# EAGLE design Clock1.3 (EAGLE 7.5.0)
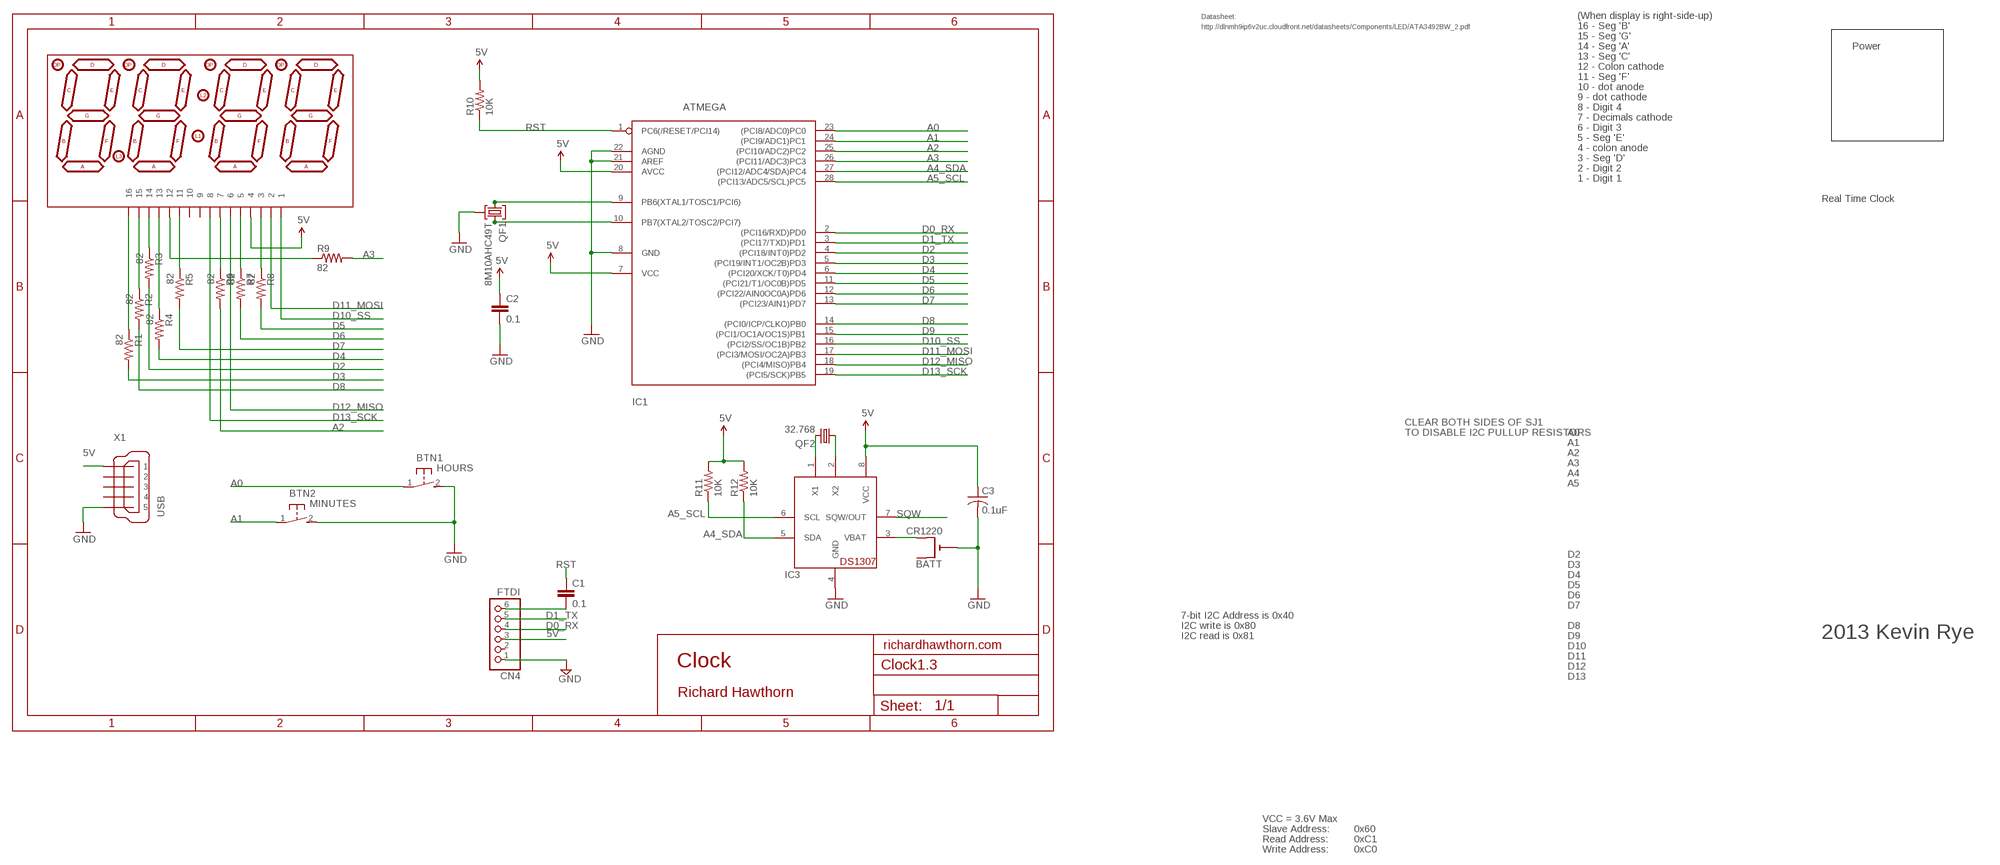
[diagram p0: schematic, sheet 1]

## Parts
BATT  CR1220  CR1220SMT  [CR1220-SMD]
BTN1  HOURS  DTS-3  [DTS-3]
BTN2  MINUTES  DTS-3  [DTS-3]
C1  0.1  CAPPTH2  [CAP-PTH-SMALL2]
C2  0.1  CAPPTH2  [CAP-PTH-SMALL2]
C3  0.1uF  C-US025-025X050  [C025-025X050]
CN4  FTDI  PINHD-1X6  [1X06]
IC1  ATMEGA  ATMEGA168PROUND  [DIL28-3-ROUND]
IC3  DS1307  [DIL08]
LED1  7SEG-4DIGIT  [SPARKFUN_7-SEGMENT-4DIGIT]
QF1  8M10AHC49T  [HC49U]
QF2  32.768  CRYTALTC38H  [TC38H]
R1  82  R-US_0204/7  [0204/7]
R2  82  R-US_0204/7  [0204/7]
R3  82  R-US_0204/7  [0204/7]
R4  82  R-US_0204/7  [0204/7]
R5  82  R-US_0204/7  [0204/7]
R6  82  R-US_0204/7  [0204/7]
R7  82  R-US_0204/7  [0204/7]
R8  82  R-US_0204/7  [0204/7]
R9  82  R-US_0204/7  [0204/7]
R10  10K  R-US_0204/7  [0204/7]
R11  10K  R-US_0204/7  [0204/7]
R12  10K  R-US_0204/7  [0204/7]
X1  USB  MINI-USB_SHIELD5P2-32005-601  [32005-601]

## Nets
5V: C2.1 C3.1 CN4.3 IC1.7(VCC) IC1.20(AVCC) IC3.8(VCC) LED1.4 R10.2 R11.2 R12.2 X1.1
A0: BTN1.1 IC1.23((PCI8/ADC0)PC0)
A1: BTN2.1 IC1.24((PCI9/ADC1)PC1)
A2: IC1.25((PCI10/ADC2)PC2) R6.2
A3: IC1.26((PCI11/ADC3)PC3) R9.2
A4_SDA: IC1.27((PCI12/ADC4/SDA)PC4) IC3.5(SDA) R12.1
A5_SCL: IC1.28((PCI13/ADC5/SCL)PC5) IC3.6(SCL) R11.1
D0_RX: CN4.4 IC1.2((PCI16/RXD)PD0)
D1_TX: CN4.5 IC1.3((PCI17/TXD)PD1)
D2: IC1.4((PCI18/INT0)PD2) R3.2
D3: IC1.5((PCI19/INT1/OC2B)PD3) R1.2
D4: IC1.6((PCI20/XCK/T0)PD4) R4.2
D5: IC1.11((PCI21/T1/OC0B)PD5) R8.2
D6: IC1.12((PCI22/AIN0OC0A)PD6) R7.2
D7: IC1.13((PCI23/AIN1)PD7) R5.2
D8: IC1.14((PCI0/ICP/CLKO)PB0) R2.2
D9: IC1.15((PCI1/OC1A/OC1S)PB1)
D10_SS: IC1.16((PCI2/SS/OC1B)PB2) LED1.1
D11_MOSI: IC1.17((PCI3/MOSI/OC2A)PB3) LED1.2
D12_MISO: IC1.18((PCI4/MISO)PB4) LED1.6
D13_SCK: IC1.19((PCI5/SCK)PB5) LED1.8
GND [power]: BATT.- BTN1.2 BTN2.2 C2.2 C3.2 CN4.1 IC1.8(GND) IC1.21(AREF) IC1.22(AGND) IC3.4(GND) QF1.2 X1.5
N$1: BATT.+$2(+1) IC3.3(VBAT)
N$3: LED1.16 R1.1
N$5: LED1.15 R2.1
N$6: LED1.12 R9.1
N$12: LED1.7 R6.1
N$14: IC3.1(X1) QF2.2
N$15: IC3.2(X2) QF2.1
N$16: IC1.9(PB6(XTAL1/TOSC1/PCI6)) QF1.1
N$20: C1.2 CN4.6
N$22: LED1.13 R4.1
N$24: LED1.14 R3.1
N$25: LED1.11 R5.1
N$26: IC1.10(PB7(XTAL2/TOSC2/PCI7)) QF1.3
N$29: LED1.5 R7.1
N$30: LED1.3 R8.1
RST: C1.1 IC1.1(PC6(/RESET/PCI14)) R10.1
SQW: IC3.7(SQW/OUT)
Unconnected: BATT.+$1(+) CN4.2 LED1.9 LED1.10 X1.2 X1.3 X1.4 X1.M1(S1) X1.M2(S2)

## Notes on the sheet
- Datasheet: | (When display is right-side-up)
- http://dlnmh9ip6v2uc.cloudfront.net/datasheets/Components/LED/ATA3492BW_2.pdf | 16 - Seg 'B'
- 15 - Seg 'G'
- 14 - Seg 'A' | Power
- 13 - Seg 'C'
- 12 - Colon cathode
- 11 - Seg 'F'
- 10 - dot anode
- 9 - dot cathode
- 8 - Digit 4
- 7 - Decimals cathode
- 6 - Digit 3
- 5 - Seg 'E'
- 4 - colon anode
- 3 - Seg 'D'
- 2 - Digit 2
- 1 - Digit 1
- Real Time Clock
- CLEAR BOTH SIDES OF SJ1
- TO DISABLE I2C PULLUP RESISTORS | A0
- A1
- A2
- A3
- A4
- A5
- D2
- D3
- D4
- D5
- D6
- D7
- 7-bit I2C Address is 0x40
- I2C write is 0x80 | D8
- I2C read is 0x81 | D9 | 2013 Kevin Rye
- richardhawthorn.com | D10
- D11
- Clock | D12
- D13
- Richard Hawthorn
- VCC = 3.6V Max
- Slave Address: | 0x60
- Read Address: | 0xC1
- Write Address: | 0xC0

## Library data of the parts
BATT = adafruit:CR1220: CR1216/CR1220/CR1225 12mm 3V lithium coin cell Great for battery packup. Both SMT and THM holders. Note the THM package has the ground pads on both sides of the PCB so that the masks are the same - this reduces the cost
BTN1 BTN2 = switch-tact:DTS-3
C1 C2 = LowPowerLab:CAP: Capacitor Standard 0603 ceramic capacitor, and 0.1" leaded capacitor.
C3 = adafruit:C-US: CAPACITOR, American symbol
CN4 = pinhead:PINHD-1X6: PIN HEADER
IC1 = adafruit:ATMEGA168*P: MICROCONTROLLER 16 kBytes FLASH 1 kBytes SRAM 512 Bytes EEPROM USART 8-channel 10 bit ADC
IC3 = adafruit:DS1307: DS1307 Real time clock (RTC) with battery backup ability. Talk to it via i2c
LED1 = sparkfun-4digit-sseg:7SEG-4DIGIT
QF1 = crystal:8M10AHC49T: Monolithic Crystal Filters Source: www.vanlong.com; OC_FARNELL: unknown; OC_NEWARK: unknown
QF2 = crystal:CRYTAL: CRYSTAL
R1-R12 = adafruit:R-US_: RESISTOR, American symbol
X1 = con-cypressindustries:MINI-USB_SHIELD5P2-: MINI USB-B R/A DIP 5pol. Source: www.cypressindustries.com; OC_FARNELL: unknown; OC_NEWARK: unknown

## Net classes
1 power: width 0.381 mm, clearance 0.254 mm

## Board
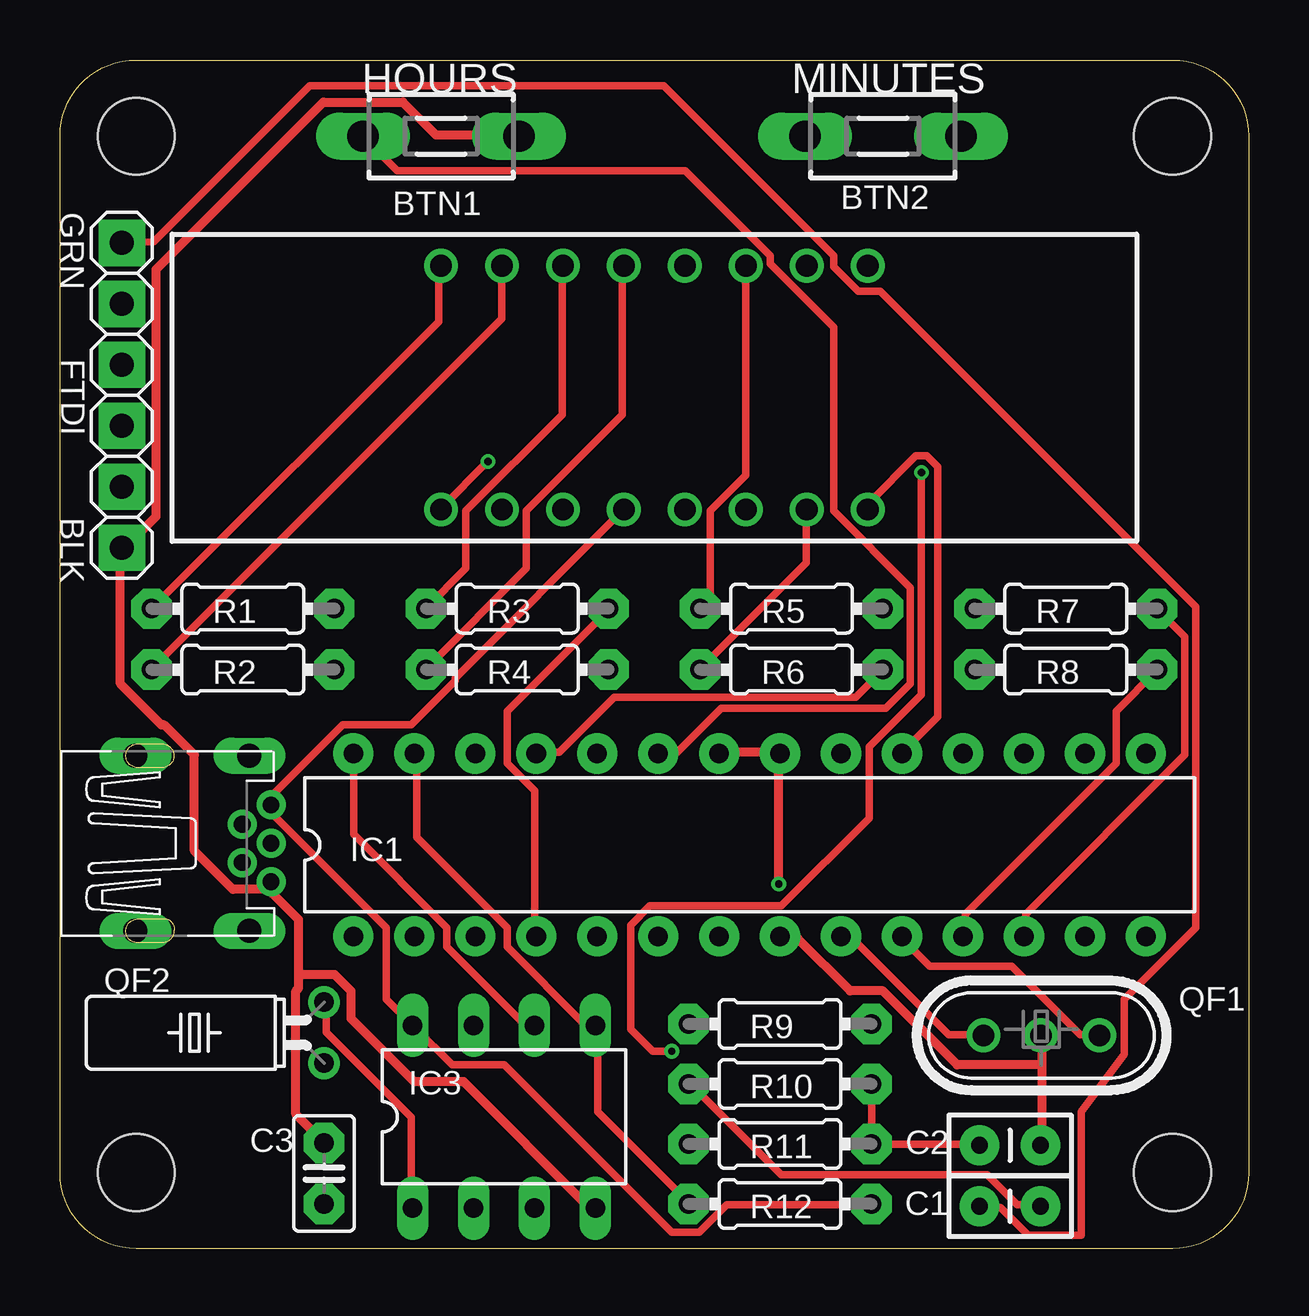
[diagram p1: board, top side]
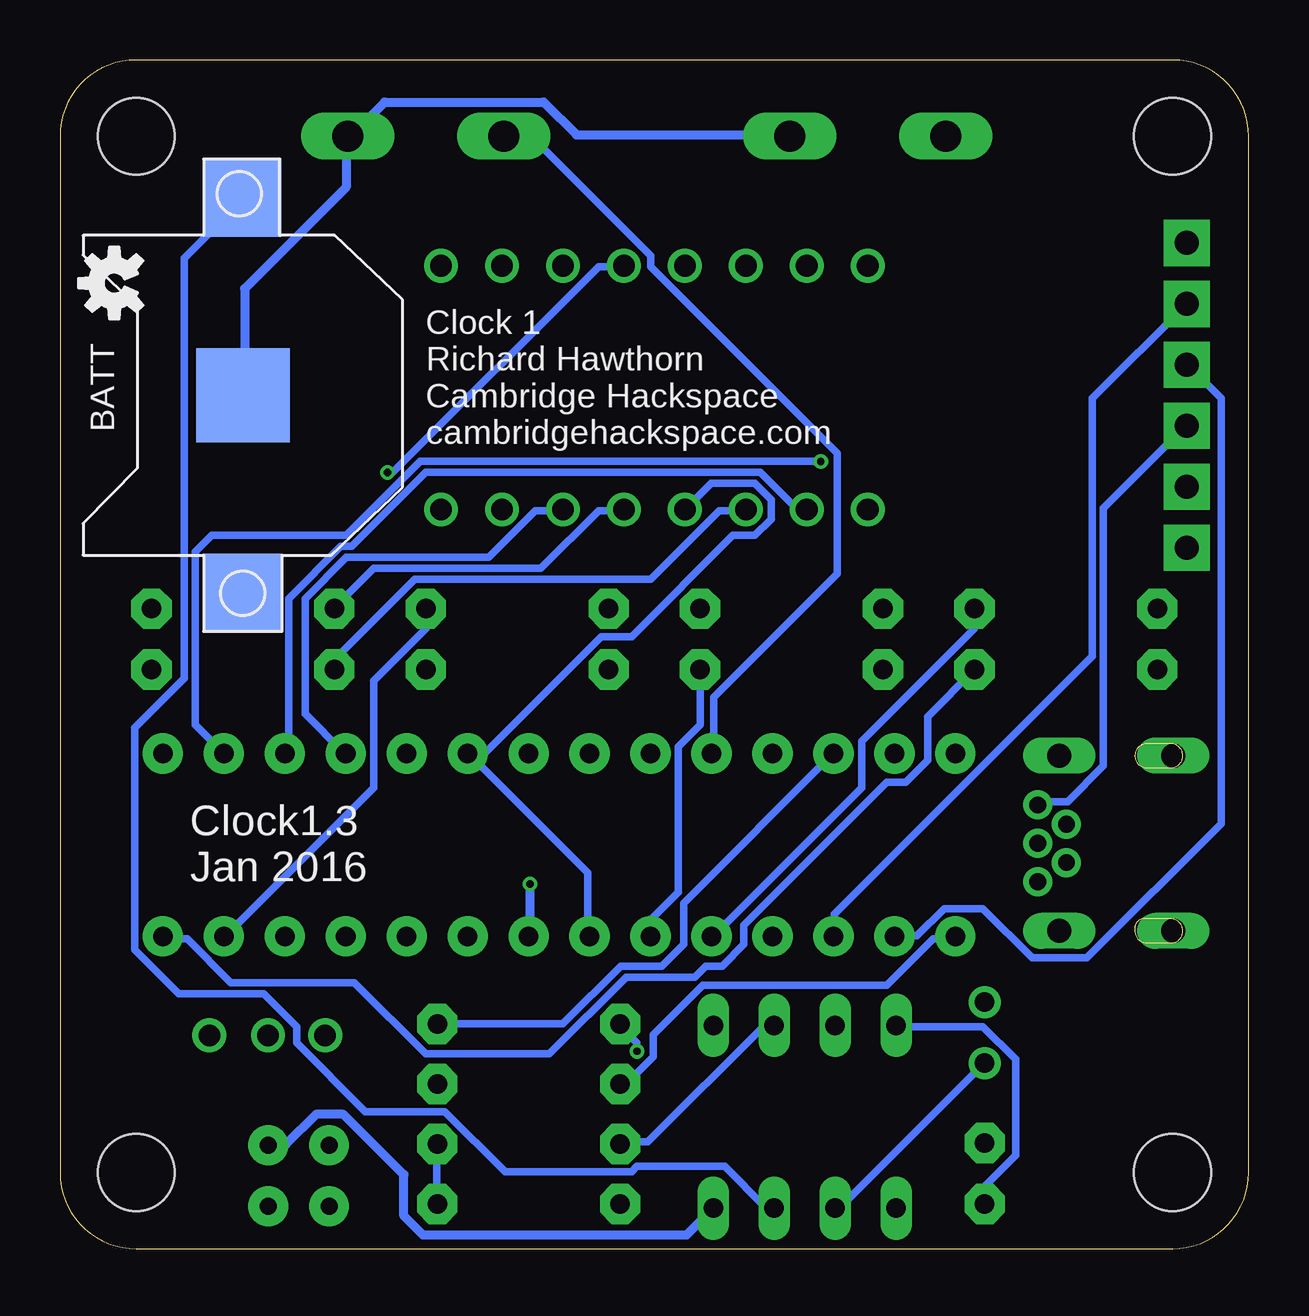
[diagram p2: board, bottom side, seen from below]

Size 49.53 x 49.53 mm. Coordinates in mm from the lower left corner, seen from the top.
Outline: 0,3.17 0,46.35 arc-90 3.17,49.53 46.35,49.53 arc-90 49.53,46.35 49.53,3.17 arc-90 46.35,0 3.17,0 arc-90 0,3.17
Copper layers (1*16): Top 0.035mm / dielectric 1.5mm / Bottom 0.035mm
Design rules "ITEADstudio_DRC *": minimum track width 12mil, minimum drill 12mil, track to track 6mil, track to pad 6mil, pad to pad 6mil, via to via 6mil, smd to smd 0mil, copper to edge 10mil, drill to drill 10mil, minimum pad ring 10mil, minimum via ring 6mil, stop-mask expansion 2mil, vias tented up to drill 100mil, thermal gap 15mil
Holes 3.2 mm at 3.17,3.17 46.35,3.17 3.17,46.35 46.35,46.35
tKeepout: area -0.1,43.1 to 6.4,49.6; area 43.2,43.2 to 49.5,49.5; area 0,0 to 6.3,6.3; area 43.2,0 to 49.5,6.3
bKeepout: area 0,43.2 to 6.3,49.5; area 0,0 to 6.3,6.3; area 43.2,0 to 49.5,6.3; area 43.2,43.2 to 49.5,49.5
tRestrict: area 24.3,8.9 to 29.1,12.8; area 5.8,16.9 to 6.9,18.5; area 5.2,9.7 to 6.7,10.4
bRestrict: area 0,43.2 to 6.3,49.5; area -0.1,-0.1 to 6.4,6.4; area 43.2,0 to 49.5,6.3; area 43.2,43.2 to 49.5,49.5

### Footprints (pad centres in the part's own frame; a part is rotated, then mirrored left to right if it is on the bottom)
CR1220-SMD = smd 3.2 x 3.2: +$1 -8.2,0; +$2 8.2,0 | smd 3.9 x 3.9: - 0,0
DTS-3 = drill 1.3 long: 1 -3.25,0; 2 3.25,0
CAP-PTH-SMALL2 = drill 0.7 pad 1.651: 1 0,0; 2 2.54,0
C025-025X050 = drill 0.813 pad 1.676 octagon: 1 -1.27,0; 2 1.27,0
1X06 = drill 1 pad 1.93 square: 1 -6.35,0; 2 -3.81,0; 3 -1.27,0; 4 1.27,0; 5 3.81,0; 6 6.35,0
DIL28-3-ROUND = drill 0.813 pad 1.676: 1 -16.51,-3.81; 2 -13.97,-3.81; 3 -11.43,-3.81; 4 -8.89,-3.81; 5 -6.35,-3.81; 6 -3.81,-3.81; 7 -1.27,-3.81; 8 1.27,-3.81; 9 3.81,-3.81; 10 6.35,-3.81; 11 8.89,-3.81; 12 11.43,-3.81; 13 13.97,-3.81; 14 16.51,-3.81; 15 16.51,3.81; 16 13.97,3.81; 17 11.43,3.81; 18 8.89,3.81; 19 6.35,3.81; 20 3.81,3.81; 21 1.27,3.81; 22 -1.27,3.81; 23 -3.81,3.81; 24 -6.35,3.81; 25 -8.89,3.81; 26 -11.43,3.81; 27 -13.97,3.81; 28 -16.51,3.81
DIL08 = drill 0.813 long: 1 -3.81,-3.81; 2 -1.27,-3.81; 3 1.27,-3.81; 4 3.81,-3.81; 5 3.81,3.81; 6 1.27,3.81; 7 -1.27,3.81; 8 -3.81,3.81
SPARKFUN_7-SEGMENT-4DIGIT = drill 0.9: 1 -8.89,-5.08; 2 -6.35,-5.08; 3 -3.81,-5.08; 4 -1.27,-5.08; 5 1.27,-5.08; 6 3.81,-5.08; 7 6.35,-5.08; 8 8.89,-5.08; 9 8.89,5.08; 10 6.35,5.08; 11 3.81,5.08; 12 1.27,5.08; 13 -1.27,5.08; 14 -3.81,5.08; 15 -6.35,5.08; 16 -8.89,5.08
HC49U = drill 0.9: 1 -2.413,0; 2 -0.027,0; 3 2.413,0
TC38H = drill 0.813: 1 -1.27,0; 2 1.27,0
0204/7 = drill 0.813 pad 1.676 octagon: 1 -3.81,0; 2 3.81,0
32005-601 = drill 0.7 pad 1.016: 1 2.825,1.6; 2 1.625,0.8; 3 2.825,0; 4 1.625,-0.8; 5 2.825,-1.6 | drill 1 pad 1.422 long: M1 -2.825,3.65; M2 -2.825,-3.65; M3 1.925,3.65; M4 1.925,-3.65

### Placement (x,y rotation side)
BATT  41.91,35.56 90 bottom
BTN1  15.88,46.35 0 top
BTN2  34.29,46.35 0 top
C1  40.85,1.77 180 top
C2  38.31,4.31 0 top
C3  11,3.13 90 top
CN4  2.58,35.56 90 top
IC1  28.73,16.83 0 top
IC3  18.5,5.5 0 top
LED1  24.77,35.88 0 top
QF1  40.89,8.89 0 top
QF2  11,9 90 top
R1  7.62,26.67 0 top
R2  7.62,24.13 0 top
R3  19.05,26.67 0 top
R4  19.05,24.13 0 top
R5  30.48,26.67 0 top
R6  30.48,24.13 0 top
R7  41.91,26.67 0 top
R8  41.91,24.13 0 top
R9  30,9.37 0 top
R10  30,6.87 0 top
R11  30,4.37 0 top
R12  30,1.86 0 top
U$3  [OSHW-LOGO-S]  47.27,40.23 90 bottom
X1  5.97,16.89 0 top

### Tracks (layer width: path | path; a pad name or v marks a point on that pad's centre or on a via)
5V
  Top 0.305: C2.1 38.29,4.34 33.83,4.34 R11.2 33.83,4.46 33.83,6.86 R10.2 | LED1.4 23.43,30.75 16.46,23.77 16.46,23.66 14.63,21.83 11.77,21.83 8.8,18.86 8.8,18.63 X1.1 8.8,18.4 8.8,18.17 13.6,13.37 13.6,10.4 14.63,9.37 IC3.8 14.74,9.26 16.34,7.66 18.52,7.66 25.49,0.69 26.63,0.69 27.77,1.83 33.72,1.83 R12.2
  Bottom 0.305: IC1.7 27.55,13.03 27.55,15.66 32.46,20.57 IC1.20 32.12,20.34 26.98,25.49 25.72,25.49 21.49,29.72 20.57,29.72 19.89,30.4 19.89,31.2 20.57,31.89 22.4,31.89 LED1.4 | R12.2 33.83,1.94 33.83,4.34 R11.2 | C3.1 10.97,1.94 10.97,2.63 9.72,3.89 9.72,7.89 11.09,9.26 14.63,9.26 IC3.8 | CN4.3 2.63,34.29 6.06,30.86 6.06,20.12 7.54,18.63 8.57,18.63 8.69,18.52 X1.1
A0
  Top 0.305: IC1.23 25.03,20.69 25.72,20.69 27.55,22.52 34.4,22.52 35.43,23.55 35.43,27.55 32.23,30.75 32.23,38.41 29.6,41.03 29.6,41.38 26.06,44.92 14.06,44.92 12.69,46.29 BTN1.1
A1
  Bottom 0.305: IC1.24 22.29,20.69 22.29,22.97 17.14,28.12 17.14,33.15 24.92,40.92 24.92,41.38 29.83,46.29 30.98,46.29 BTN2.1
A2
  Top 0.305: IC1.25 19.89,20.69 20.8,20.69 23.09,22.97 33.15,22.97 34.29,24.12 R6.2
A3
  Bottom 0.305: R9.2 33.72,9.37 28.57,9.37 26.18,11.77 24.46,11.77 23.55,12.69 23.55,14.4 17.37,20.57 IC1.26
A4_SDA
  Top 0.305: R12.1 26.18,1.94 22.4,5.71 22.4,9.26 IC3.5 22.17,9.37 21.83,9.37 18.63,12.57 18.63,13.37 14.86,17.14 14.86,20.57 IC1.27
A5_SCL
  Top 0.305: IC1.28 12.23,20.57 12.23,17.26 16.12,13.37 16.12,12.57 19.32,9.37 19.66,9.37 IC3.6
  Bottom 0.305: IC3.6 19.77,9.26 20.23,9.26 25.03,4.46 26.18,4.46 R11.1
D0_RX
  Bottom 0.305: IC1.2 14.74,13.03 13.83,13.03 12.69,14.17 11.09,14.17 9.03,12.12 6.74,12.12 1.14,17.72 1.14,35.43 2.52,36.8 CN4.4
D1_TX
  Bottom 0.305: IC1.3 17.26,13.03 17.26,13.95 6.51,24.69 6.51,35.43 2.63,39.32 CN4.5
D2
  Top 0.305: IC1.4 19.77,13.03 19.77,19.09 18.63,20.23 18.63,22.4 22.86,26.63 R3.2
D3
  Bottom 0.305: R1.2 11.43,25.83 16.12,21.14 16.12,19.2 22.29,13.03 IC1.5
D4
  Bottom 0.305: R4.2 22.86,21.83 23.77,20.92 23.77,14.86 24.92,13.72 IC1.6
D5
  Top 0.305: IC1.11 37.72,13.03 37.72,13.95 44.01,20.23 44.01,22.4 45.72,24.12 R8.2
D6
  Top 0.305: IC1.12 40.23,13.03 40.23,13.95 46.86,20.57 46.86,25.49 45.72,26.63 R7.2
D7
  Bottom 0.305: R5.2 34.29,25.83 36.46,23.66 36.46,19.2 42.63,13.03 IC1.13
D8
  Bottom 0.305: IC1.14 45.15,12.92 44.23,12.92 42.41,11.09 37.26,11.09 34.29,8.12 29.15,8.12 25.95,11.32 23.09,11.32 22.63,11.77 21.95,11.77 21.03,12.69 21.03,13.49 15.09,19.43 14.29,19.43 13.37,20.34 13.37,22.17 11.43,24.12 R2.2
D10_SS  (via drill 0.3)
  Top 0.305: v17.83,32.8 15.89,30.86 LED1.1
  Bottom 0.305: v17.83,32.8 34.52,32.8 37.6,29.72 43.2,29.72 43.89,29.03 43.89,21.83 42.75,20.69 IC1.16
D11_MOSI
  Bottom 0.305: LED1.2 18.52,30.86 18.86,30.86 20.34,32.35 34.29,32.35 37.38,29.26 37.83,29.26 40.01,27.09 40.01,20.8 40.12,20.69 IC1.17
D12_MISO
  Bottom 0.305: LED1.6 28.57,30.75 29.72,30.75 31.66,28.8 37.6,28.8 39.32,27.09 39.32,22.29 37.72,20.69 IC1.18
D13_SCK
  Top 0.305: LED1.8 33.72,30.86 33.72,31.09 35.66,33.03 36.12,33.03 36.58,32.58 36.58,22.17 35.09,20.69 IC1.19
GND  (via drill 0.3)
  Top 0.381: IC1.22 27.55,20.69 29.95,20.69 IC1.21 29.95,20.46 v29.95,15.2 | 40.92,7.66 40.92,4.34 C2.2 | 40.92,7.66 40.92,8.8 QF1.2 | 40.92,7.66 37.38,7.66 34.29,10.74 32.92,10.74 30.75,12.92 30.06,12.92 IC1.8 | 9.94,11.43 9.94,10.86 9.83,10.74 9.83,5.6 10.97,4.46 C3.2 | 9.94,11.43 9.94,13.72 8.8,14.86 8.8,15.2 X1.5 8.69,14.97 7.2,14.97 5.6,16.57 5.6,20.57 4.34,21.83 4.23,21.83 2.52,23.55 2.52,29.15 CN4.1 2.74,29.26 4,30.52 4,40.8 10.97,47.78 14.29,47.78 15.66,46.41 19.09,46.41 BTN1.2 | 9.94,11.43 11.43,11.43 12.12,10.74 12.12,9.6 14.74,6.97 16.8,6.97 22.06,1.71 22.29,1.71 IC3.4
  Bottom 0.381: BATT.- 41.83,35.66 41.83,40.01 37.6,44.23 37.6,46.29 BTN2.2 37.38,46.41 36.01,47.78 29.38,47.78 28,46.41 19.2,46.41 BTN1.2 | v29.95,15.2 29.95,13.03 IC1.8 | C2.2 40.8,4.34 40.12,4.34 38.86,5.6 37.72,5.6 35.2,3.09 35.2,1.37 34.4,0.57 23.43,0.57 22.4,1.6 IC3.4
N$1
  Bottom 0.305: IC3.3 19.77,1.71 20.12,1.71 21.83,3.43 25.49,3.43 25.72,3.2 30.98,3.2 33.49,5.71 36.8,5.71 39.66,8.57 39.66,9.26 41.03,10.63 44.58,10.63 46.41,12.46 46.41,21.72 44.35,23.77 44.35,41.26 41.95,43.66 BATT.+$2
N$3
  Top 0.305: R1.1 15.77,38.63 15.77,40.92 LED1.16
N$5
  Top 0.305: LED1.15 18.4,40.92 18.4,38.75 3.89,24.23 R2.1
N$6  (via drill 0.3)
  Top 0.305: v35.89,32.35 35.89,23.09 33.72,20.92 33.72,17.95 30.06,14.29 24.57,14.29 23.77,13.49 23.77,9.14 24.69,8.23 v25.49,8.23
  Bottom 0.305: v35.89,32.35 35.66,32.35 27.09,40.92 26.06,40.92 LED1.12 | v25.49,8.23 25.49,8.57 26.18,9.26 R9.1
N$12
  Top 0.305: LED1.7 31.09,30.75 31.09,28.57 26.75,24.23 R6.1
N$14
  Top 0.305: QF2.2 11.09,10.17 11.09,9.03 14.63,5.49 14.63,1.71 IC3.1
N$15
  Bottom 0.305: QF2.1 11.09,7.66 17.14,1.6 IC3.2
N$16
  Top 0.305: QF1.1 38.41,8.91 37.03,8.91 33.03,12.92 32.58,12.92 IC1.9
N$20
  Top 0.305: C1.2 38.41,1.71 39.2,1.71 40.35,0.57 42.55,0.57 42.55,5.71 44.35,8.1 44.35,10.4 47.32,13.37 47.32,26.75 34.18,39.89 33.26,39.89 32.23,40.92 32.23,41.38 25.15,48.46 10.41,48.46 3.9,41.95 CN4.6
N$22
  Top 0.305: LED1.13 23.43,40.92 23.43,34.75 19.43,30.75 19.43,28.35 15.32,24.23 R4.1
N$24
  Top 0.305: R3.1 16.92,28.35 16.92,30.75 20.92,34.75 20.92,40.92 LED1.14
N$25
  Top 0.305: LED1.11 28.57,32.23 27.09,30.75 27.09,27.09 R5.1
N$26
  Top 0.305: QF1.3 43.2,8.91 42.52,8.91 39.66,11.77 36.23,11.77 35.09,12.92 IC1.10
N$29
  Bottom 0.305: LED1.5 26.06,30.75 27.09,30.75 29.49,28.35 36.46,28.35 38.06,26.75 R7.1
N$30
  Bottom 0.305: LED1.3 21.03,30.75 22.06,30.75 24.92,27.89 34.75,27.89 38.06,24.57 38.06,24.23 R8.1
RST
  Top 0.305: C1.1 40.8,1.83 39.89,1.83 38.63,3.09 30.06,3.09 26.29,6.86 R10.1
  Bottom 0.305: IC1.1 12.23,12.92 13.14,12.92 15.09,10.97 22.75,10.97 24.8,8.91 24.8,8 25.83,6.97 26.18,6.97 R10.1

### Text on the board
tNames: GRN | FTDI | BLK
bNames: Clock 1 / Richard Hawthorn / Cambridge Hackspace / cambridgehackspace.com | Clock1.3 / Jan 2016
tDocu: REG